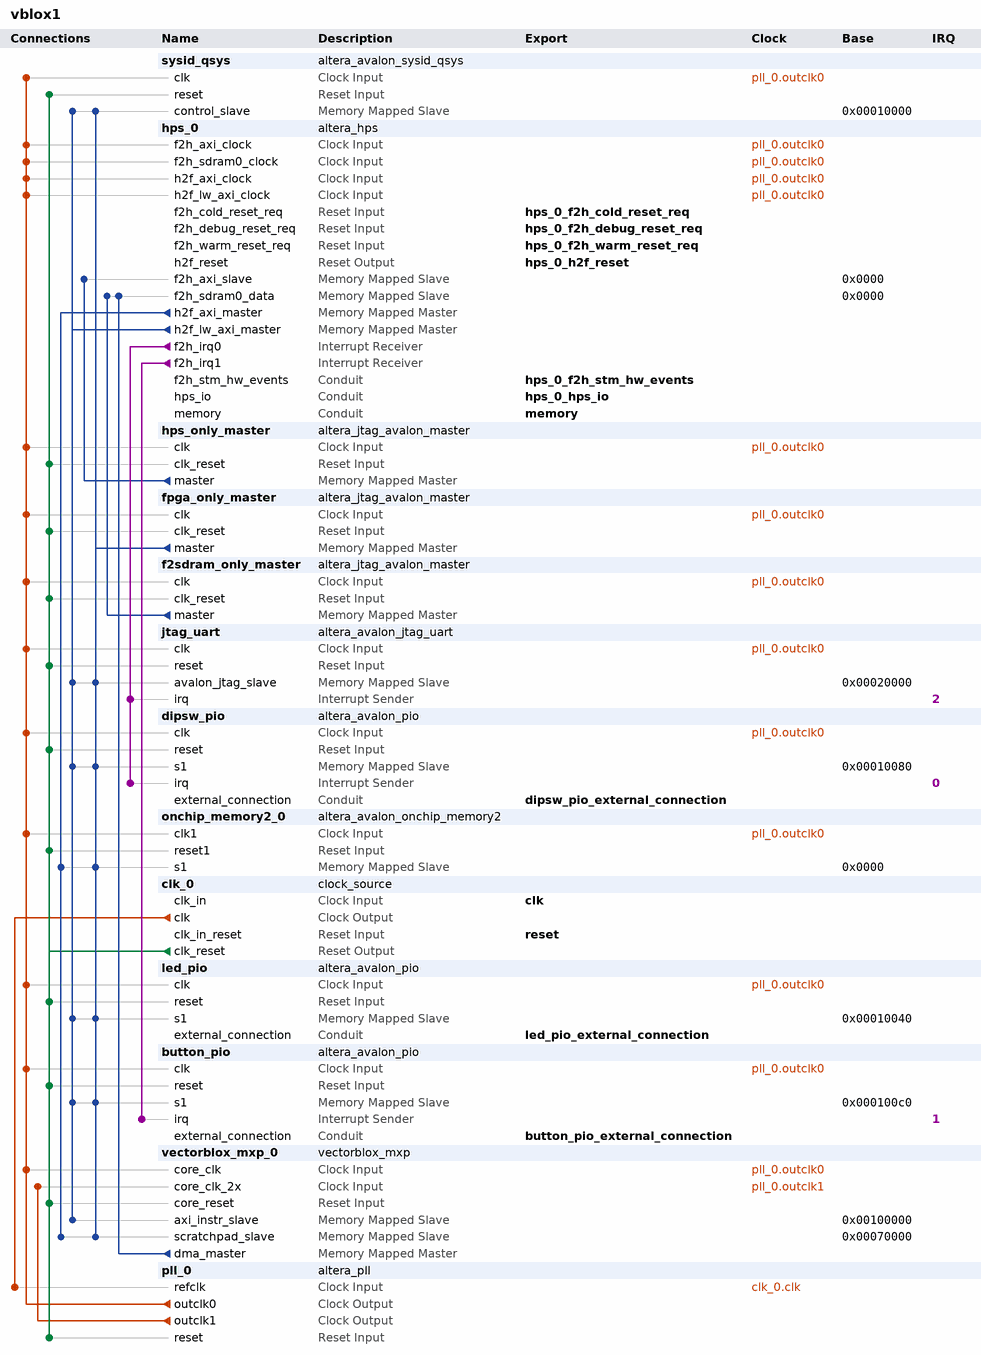
[diagram p0: system contents]
# Platform Designer (Qsys) system vblox1, Cyclone V 5CSXFC6D6F31C6
# Parameters at their usual value, and those the tool derives, are not listed.
package require -exact qsys 15.0
create_system vblox1
set_project_property DEVICE_FAMILY {Cyclone V}
set_project_property DEVICE 5CSXFC6D6F31C6

add_instance sysid_qsys altera_avalon_sysid_qsys 15.0
set_instance_parameter_value sysid_qsys id -1395322110

add_instance hps_0 altera_hps 15.0
set_instance_parameter_value hps_0 EMAC1_Mode RGMII
set_instance_parameter_value hps_0 EMAC1_PinMuxing {HPS I/O Set 0}
set_instance_parameter_value hps_0 F2SCLK_COLDRST_Enable true
set_instance_parameter_value hps_0 F2SCLK_DBGRST_Enable true
set_instance_parameter_value hps_0 F2SCLK_WARMRST_Enable true
set_instance_parameter_value hps_0 F2SDRAM_Type {Avalon-MM Bidirectional}
set_instance_parameter_value hps_0 F2SDRAM_Width 256
set_instance_parameter_value hps_0 F2SINTERRUPT_Enable true
set_instance_parameter_value hps_0 F2S_Width 3
set_instance_parameter_value hps_0 FPGA_PERIPHERAL_OUTPUT_CLOCK_FREQ_EMAC0_GTX_CLK 100
set_instance_parameter_value hps_0 FPGA_PERIPHERAL_OUTPUT_CLOCK_FREQ_EMAC0_MD_CLK 100.0
set_instance_parameter_value hps_0 FPGA_PERIPHERAL_OUTPUT_CLOCK_FREQ_EMAC1_GTX_CLK 100
set_instance_parameter_value hps_0 FPGA_PERIPHERAL_OUTPUT_CLOCK_FREQ_EMAC1_MD_CLK 100.0
set_instance_parameter_value hps_0 HPS_PROTOCOL DDR3
set_instance_parameter_value hps_0 I2C0_Mode N/A
set_instance_parameter_value hps_0 I2C0_PinMuxing Unused
set_instance_parameter_value hps_0 I2C1_Mode I2C
set_instance_parameter_value hps_0 I2C1_PinMuxing {HPS I/O Set 0}
set_instance_parameter_value hps_0 LWH2F_Enable true
set_instance_parameter_value hps_0 MEM_BANKADDR_WIDTH 3
set_instance_parameter_value hps_0 MEM_CLK_FREQ 400.0
set_instance_parameter_value hps_0 MEM_COL_ADDR_WIDTH 10
set_instance_parameter_value hps_0 MEM_DQ_WIDTH 32
set_instance_parameter_value hps_0 MEM_DRV_STR RZQ/7
set_instance_parameter_value hps_0 MEM_ROW_ADDR_WIDTH 15
set_instance_parameter_value hps_0 MEM_RTT_NOM RZQ/4
set_instance_parameter_value hps_0 MEM_RTT_WR RZQ/4
set_instance_parameter_value hps_0 MEM_TCL 11
set_instance_parameter_value hps_0 MEM_TFAW_NS 30.0
set_instance_parameter_value hps_0 MEM_TRAS_NS 35.0
set_instance_parameter_value hps_0 MEM_TRCD_NS 13.75
set_instance_parameter_value hps_0 MEM_TRFC_NS 260.0
set_instance_parameter_value hps_0 MEM_TRP_NS 13.75
set_instance_parameter_value hps_0 MEM_VENDOR Micron
set_instance_parameter_value hps_0 MEM_WTCL 8
set_instance_parameter_value hps_0 QSPI_Mode {1 SS}
set_instance_parameter_value hps_0 QSPI_PinMuxing {HPS I/O Set 0}
set_instance_parameter_value hps_0 REF_CLK_FREQ 25.0
set_instance_parameter_value hps_0 S2F_Width 2
set_instance_parameter_value hps_0 SDIO_Mode {4-bit Data}
set_instance_parameter_value hps_0 SDIO_PinMuxing {HPS I/O Set 0}
set_instance_parameter_value hps_0 SPIM0_Mode {Single Slave Select}
set_instance_parameter_value hps_0 SPIM0_PinMuxing {HPS I/O Set 0}
set_instance_parameter_value hps_0 SPIM1_Mode {Single Slave Select}
set_instance_parameter_value hps_0 SPIM1_PinMuxing {HPS I/O Set 0}
set_instance_parameter_value hps_0 STM_Enable true
set_instance_parameter_value hps_0 TIMING_BOARD_AC_SKEW 0.03
set_instance_parameter_value hps_0 TIMING_BOARD_AC_TO_CK_SKEW 0.0
set_instance_parameter_value hps_0 TIMING_BOARD_DQ_TO_DQS_SKEW 0.0
set_instance_parameter_value hps_0 TIMING_BOARD_MAX_CK_DELAY 0.03
set_instance_parameter_value hps_0 TIMING_BOARD_MAX_DQS_DELAY 0.02
set_instance_parameter_value hps_0 TIMING_BOARD_SKEW_BETWEEN_DQS 0.08
set_instance_parameter_value hps_0 TIMING_BOARD_SKEW_CKDQS_DIMM_MAX 0.16
set_instance_parameter_value hps_0 TIMING_BOARD_SKEW_CKDQS_DIMM_MIN 0.09
set_instance_parameter_value hps_0 TIMING_BOARD_SKEW_WITHIN_DQS 0.01
set_instance_parameter_value hps_0 TIMING_TDH 65
set_instance_parameter_value hps_0 TIMING_TDQSCK 255
set_instance_parameter_value hps_0 TIMING_TDQSQ 125
set_instance_parameter_value hps_0 TIMING_TDS 30
set_instance_parameter_value hps_0 TIMING_TIH 140
set_instance_parameter_value hps_0 TIMING_TIS 180
set_instance_parameter_value hps_0 TIMING_TQSH 0.4
set_instance_parameter_value hps_0 UART0_Mode {No Flow Control}
set_instance_parameter_value hps_0 UART0_PinMuxing {HPS I/O Set 0}
set_instance_parameter_value hps_0 USB1_Mode N/A
set_instance_parameter_value hps_0 USB1_PinMuxing Unused
set_instance_parameter_value hps_0 desired_cfg_clk_mhz 100.0
set_instance_parameter_value hps_0 desired_qspi_clk_mhz 400.0
set_instance_parameter_value hps_0 use_default_mpu_clk false

add_instance hps_only_master altera_jtag_avalon_master 15.0

add_instance fpga_only_master altera_jtag_avalon_master 15.0

add_instance f2sdram_only_master altera_jtag_avalon_master 15.0

add_instance jtag_uart altera_avalon_jtag_uart 15.0
set_instance_parameter_value jtag_uart allowMultipleConnections true
set_instance_parameter_value jtag_uart simInteractiveOptions INTERACTIVE_ASCII_OUTPUT

add_instance dipsw_pio altera_avalon_pio 15.0
set_instance_parameter_value dipsw_pio bitClearingEdgeCapReg true
set_instance_parameter_value dipsw_pio captureEdge true
set_instance_parameter_value dipsw_pio direction Input
set_instance_parameter_value dipsw_pio edgeType ANY
set_instance_parameter_value dipsw_pio generateIRQ true
set_instance_parameter_value dipsw_pio irqType EDGE
set_instance_parameter_value dipsw_pio width 4

add_instance onchip_memory2_0 altera_avalon_onchip_memory2 15.0
set_instance_parameter_value onchip_memory2_0 dataWidth 64
set_instance_parameter_value onchip_memory2_0 dualPort false
set_instance_parameter_value onchip_memory2_0 initMemContent true
set_instance_parameter_value onchip_memory2_0 initializationFileName onchip_memory2_0
set_instance_parameter_value onchip_memory2_0 memorySize 65536

add_instance clk_0 clock_source 15.0
set_instance_parameter_value clk_0 clockFrequency 50000000

add_instance led_pio altera_avalon_pio 15.0
set_instance_parameter_value led_pio direction Output
set_instance_parameter_value led_pio width 4

add_instance button_pio altera_avalon_pio 15.0
set_instance_parameter_value button_pio captureEdge true
set_instance_parameter_value button_pio direction Input
set_instance_parameter_value button_pio edgeType FALLING
set_instance_parameter_value button_pio generateIRQ true
set_instance_parameter_value button_pio irqType EDGE
set_instance_parameter_value button_pio width 4

add_instance vectorblox_mxp_0 vectorblox_mxp 1.1
set_instance_parameter_value vectorblox_mxp_0 BEATS_PER_BURST 32
set_instance_parameter_value vectorblox_mxp_0 CI_CLK_DOMAIN 0
set_instance_parameter_value vectorblox_mxp_0 CI_CLK_RATE 0
set_instance_parameter_value vectorblox_mxp_0 CORE_CLK_2X_DOMAIN 8
set_instance_parameter_value vectorblox_mxp_0 CORE_CLK_2X_RATE 200000000
set_instance_parameter_value vectorblox_mxp_0 CORE_CLK_DOMAIN 7
set_instance_parameter_value vectorblox_mxp_0 CORE_CLK_RATE 100000000
set_instance_parameter_value vectorblox_mxp_0 INSTR_PORT_ID_WIDTH 14
set_instance_parameter_value vectorblox_mxp_0 INSTR_PORT_TYPE AXI
set_instance_parameter_value vectorblox_mxp_0 MASK_PARTITIONS 1
set_instance_parameter_value vectorblox_mxp_0 MAX_MASKED_WAVES 256
set_instance_parameter_value vectorblox_mxp_0 MEMORY_WIDTH_LANES 8
set_instance_parameter_value vectorblox_mxp_0 MIN_MULTIPLIER_HW BYTE
set_instance_parameter_value vectorblox_mxp_0 MULFXP_BYTE_FRACTION_BITS 4
set_instance_parameter_value vectorblox_mxp_0 MULFXP_HALF_FRACTION_BITS 15
set_instance_parameter_value vectorblox_mxp_0 MULFXP_WORD_FRACTION_BITS 16
set_instance_parameter_value vectorblox_mxp_0 SCRATCHPAD_KB 64
set_instance_parameter_value vectorblox_mxp_0 SLAVE_WIDTH_LANES 1
set_instance_parameter_value vectorblox_mxp_0 UNIQUE_ID {$${FILENAME}_vectorblox_mxp_0}
set_instance_parameter_value vectorblox_mxp_0 VCI_0_FUNCTIONS 1
set_instance_parameter_value vectorblox_mxp_0 VCI_0_FUNCTION_0_DEPTH 0
set_instance_parameter_value vectorblox_mxp_0 VCI_0_FUNCTION_10_DEPTH 0
set_instance_parameter_value vectorblox_mxp_0 VCI_0_FUNCTION_11_DEPTH 0
set_instance_parameter_value vectorblox_mxp_0 VCI_0_FUNCTION_12_DEPTH 0
set_instance_parameter_value vectorblox_mxp_0 VCI_0_FUNCTION_13_DEPTH 0
set_instance_parameter_value vectorblox_mxp_0 VCI_0_FUNCTION_14_DEPTH 0
set_instance_parameter_value vectorblox_mxp_0 VCI_0_FUNCTION_15_DEPTH 0
set_instance_parameter_value vectorblox_mxp_0 VCI_0_FUNCTION_1_DEPTH 0
set_instance_parameter_value vectorblox_mxp_0 VCI_0_FUNCTION_2_DEPTH 0
set_instance_parameter_value vectorblox_mxp_0 VCI_0_FUNCTION_3_DEPTH 0
set_instance_parameter_value vectorblox_mxp_0 VCI_0_FUNCTION_4_DEPTH 0
set_instance_parameter_value vectorblox_mxp_0 VCI_0_FUNCTION_5_DEPTH 0
set_instance_parameter_value vectorblox_mxp_0 VCI_0_FUNCTION_6_DEPTH 0
set_instance_parameter_value vectorblox_mxp_0 VCI_0_FUNCTION_7_DEPTH 0
set_instance_parameter_value vectorblox_mxp_0 VCI_0_FUNCTION_8_DEPTH 0
set_instance_parameter_value vectorblox_mxp_0 VCI_0_FUNCTION_9_DEPTH 0
set_instance_parameter_value vectorblox_mxp_0 VCI_0_LANES 1
set_instance_parameter_value vectorblox_mxp_0 VCI_0_MODIFIES_DEST_ADDR false
set_instance_parameter_value vectorblox_mxp_0 VCI_0_OPCODE_START 0
set_instance_parameter_value vectorblox_mxp_0 VCI_10_FUNCTIONS 1
set_instance_parameter_value vectorblox_mxp_0 VCI_10_FUNCTION_0_DEPTH 0
set_instance_parameter_value vectorblox_mxp_0 VCI_10_FUNCTION_1_DEPTH 0
set_instance_parameter_value vectorblox_mxp_0 VCI_10_FUNCTION_2_DEPTH 0
set_instance_parameter_value vectorblox_mxp_0 VCI_10_FUNCTION_3_DEPTH 0
set_instance_parameter_value vectorblox_mxp_0 VCI_10_FUNCTION_4_DEPTH 0
set_instance_parameter_value vectorblox_mxp_0 VCI_10_FUNCTION_5_DEPTH 0
set_instance_parameter_value vectorblox_mxp_0 VCI_10_LANES 1
set_instance_parameter_value vectorblox_mxp_0 VCI_10_MODIFIES_DEST_ADDR false
set_instance_parameter_value vectorblox_mxp_0 VCI_10_OPCODE_START 10
set_instance_parameter_value vectorblox_mxp_0 VCI_11_FUNCTIONS 1
set_instance_parameter_value vectorblox_mxp_0 VCI_11_FUNCTION_0_DEPTH 0
set_instance_parameter_value vectorblox_mxp_0 VCI_11_FUNCTION_1_DEPTH 0
set_instance_parameter_value vectorblox_mxp_0 VCI_11_FUNCTION_2_DEPTH 0
set_instance_parameter_value vectorblox_mxp_0 VCI_11_FUNCTION_3_DEPTH 0
set_instance_parameter_value vectorblox_mxp_0 VCI_11_FUNCTION_4_DEPTH 0
set_instance_parameter_value vectorblox_mxp_0 VCI_11_LANES 1
set_instance_parameter_value vectorblox_mxp_0 VCI_11_MODIFIES_DEST_ADDR false
set_instance_parameter_value vectorblox_mxp_0 VCI_11_OPCODE_START 11
set_instance_parameter_value vectorblox_mxp_0 VCI_12_FUNCTIONS 1
set_instance_parameter_value vectorblox_mxp_0 VCI_12_FUNCTION_0_DEPTH 0
set_instance_parameter_value vectorblox_mxp_0 VCI_12_FUNCTION_1_DEPTH 0
set_instance_parameter_value vectorblox_mxp_0 VCI_12_FUNCTION_2_DEPTH 0
set_instance_parameter_value vectorblox_mxp_0 VCI_12_FUNCTION_3_DEPTH 0
set_instance_parameter_value vectorblox_mxp_0 VCI_12_LANES 1
set_instance_parameter_value vectorblox_mxp_0 VCI_12_MODIFIES_DEST_ADDR false
set_instance_parameter_value vectorblox_mxp_0 VCI_12_OPCODE_START 12
set_instance_parameter_value vectorblox_mxp_0 VCI_13_FUNCTIONS 1
set_instance_parameter_value vectorblox_mxp_0 VCI_13_FUNCTION_0_DEPTH 0
set_instance_parameter_value vectorblox_mxp_0 VCI_13_FUNCTION_1_DEPTH 0
set_instance_parameter_value vectorblox_mxp_0 VCI_13_FUNCTION_2_DEPTH 0
set_instance_parameter_value vectorblox_mxp_0 VCI_13_LANES 1
set_instance_parameter_value vectorblox_mxp_0 VCI_13_MODIFIES_DEST_ADDR false
set_instance_parameter_value vectorblox_mxp_0 VCI_13_OPCODE_START 13
set_instance_parameter_value vectorblox_mxp_0 VCI_14_FUNCTIONS 1
set_instance_parameter_value vectorblox_mxp_0 VCI_14_FUNCTION_0_DEPTH 0
set_instance_parameter_value vectorblox_mxp_0 VCI_14_FUNCTION_1_DEPTH 0
set_instance_parameter_value vectorblox_mxp_0 VCI_14_LANES 1
set_instance_parameter_value vectorblox_mxp_0 VCI_14_MODIFIES_DEST_ADDR false
set_instance_parameter_value vectorblox_mxp_0 VCI_14_OPCODE_START 14
set_instance_parameter_value vectorblox_mxp_0 VCI_15_FUNCTIONS 1
set_instance_parameter_value vectorblox_mxp_0 VCI_15_FUNCTION_0_DEPTH 0
set_instance_parameter_value vectorblox_mxp_0 VCI_15_LANES 1
set_instance_parameter_value vectorblox_mxp_0 VCI_15_MODIFIES_DEST_ADDR false
set_instance_parameter_value vectorblox_mxp_0 VCI_15_OPCODE_START 15
set_instance_parameter_value vectorblox_mxp_0 VCI_1_FUNCTIONS 1
set_instance_parameter_value vectorblox_mxp_0 VCI_1_FUNCTION_0_DEPTH 0
set_instance_parameter_value vectorblox_mxp_0 VCI_1_FUNCTION_10_DEPTH 0
set_instance_parameter_value vectorblox_mxp_0 VCI_1_FUNCTION_11_DEPTH 0
set_instance_parameter_value vectorblox_mxp_0 VCI_1_FUNCTION_12_DEPTH 0
set_instance_parameter_value vectorblox_mxp_0 VCI_1_FUNCTION_13_DEPTH 0
set_instance_parameter_value vectorblox_mxp_0 VCI_1_FUNCTION_14_DEPTH 0
set_instance_parameter_value vectorblox_mxp_0 VCI_1_FUNCTION_1_DEPTH 0
set_instance_parameter_value vectorblox_mxp_0 VCI_1_FUNCTION_2_DEPTH 0
set_instance_parameter_value vectorblox_mxp_0 VCI_1_FUNCTION_3_DEPTH 0
set_instance_parameter_value vectorblox_mxp_0 VCI_1_FUNCTION_4_DEPTH 0
set_instance_parameter_value vectorblox_mxp_0 VCI_1_FUNCTION_5_DEPTH 0
set_instance_parameter_value vectorblox_mxp_0 VCI_1_FUNCTION_6_DEPTH 0
set_instance_parameter_value vectorblox_mxp_0 VCI_1_FUNCTION_7_DEPTH 0
set_instance_parameter_value vectorblox_mxp_0 VCI_1_FUNCTION_8_DEPTH 0
set_instance_parameter_value vectorblox_mxp_0 VCI_1_FUNCTION_9_DEPTH 0
set_instance_parameter_value vectorblox_mxp_0 VCI_1_LANES 1
set_instance_parameter_value vectorblox_mxp_0 VCI_1_MODIFIES_DEST_ADDR false
set_instance_parameter_value vectorblox_mxp_0 VCI_1_OPCODE_START 1
set_instance_parameter_value vectorblox_mxp_0 VCI_2_FUNCTIONS 1
set_instance_parameter_value vectorblox_mxp_0 VCI_2_FUNCTION_0_DEPTH 0
set_instance_parameter_value vectorblox_mxp_0 VCI_2_FUNCTION_10_DEPTH 0
set_instance_parameter_value vectorblox_mxp_0 VCI_2_FUNCTION_11_DEPTH 0
set_instance_parameter_value vectorblox_mxp_0 VCI_2_FUNCTION_12_DEPTH 0
set_instance_parameter_value vectorblox_mxp_0 VCI_2_FUNCTION_13_DEPTH 0
set_instance_parameter_value vectorblox_mxp_0 VCI_2_FUNCTION_1_DEPTH 0
set_instance_parameter_value vectorblox_mxp_0 VCI_2_FUNCTION_2_DEPTH 0
set_instance_parameter_value vectorblox_mxp_0 VCI_2_FUNCTION_3_DEPTH 0
set_instance_parameter_value vectorblox_mxp_0 VCI_2_FUNCTION_4_DEPTH 0
set_instance_parameter_value vectorblox_mxp_0 VCI_2_FUNCTION_5_DEPTH 0
set_instance_parameter_value vectorblox_mxp_0 VCI_2_FUNCTION_6_DEPTH 0
set_instance_parameter_value vectorblox_mxp_0 VCI_2_FUNCTION_7_DEPTH 0
set_instance_parameter_value vectorblox_mxp_0 VCI_2_FUNCTION_8_DEPTH 0
set_instance_parameter_value vectorblox_mxp_0 VCI_2_FUNCTION_9_DEPTH 0
set_instance_parameter_value vectorblox_mxp_0 VCI_2_LANES 1
set_instance_parameter_value vectorblox_mxp_0 VCI_2_MODIFIES_DEST_ADDR false
set_instance_parameter_value vectorblox_mxp_0 VCI_2_OPCODE_START 2
set_instance_parameter_value vectorblox_mxp_0 VCI_3_FUNCTIONS 1
set_instance_parameter_value vectorblox_mxp_0 VCI_3_FUNCTION_0_DEPTH 0
set_instance_parameter_value vectorblox_mxp_0 VCI_3_FUNCTION_10_DEPTH 0
set_instance_parameter_value vectorblox_mxp_0 VCI_3_FUNCTION_11_DEPTH 0
set_instance_parameter_value vectorblox_mxp_0 VCI_3_FUNCTION_12_DEPTH 0
set_instance_parameter_value vectorblox_mxp_0 VCI_3_FUNCTION_1_DEPTH 0
set_instance_parameter_value vectorblox_mxp_0 VCI_3_FUNCTION_2_DEPTH 0
set_instance_parameter_value vectorblox_mxp_0 VCI_3_FUNCTION_3_DEPTH 0
set_instance_parameter_value vectorblox_mxp_0 VCI_3_FUNCTION_4_DEPTH 0
set_instance_parameter_value vectorblox_mxp_0 VCI_3_FUNCTION_5_DEPTH 0
set_instance_parameter_value vectorblox_mxp_0 VCI_3_FUNCTION_6_DEPTH 0
set_instance_parameter_value vectorblox_mxp_0 VCI_3_FUNCTION_7_DEPTH 0
set_instance_parameter_value vectorblox_mxp_0 VCI_3_FUNCTION_8_DEPTH 0
set_instance_parameter_value vectorblox_mxp_0 VCI_3_FUNCTION_9_DEPTH 0
set_instance_parameter_value vectorblox_mxp_0 VCI_3_LANES 1
set_instance_parameter_value vectorblox_mxp_0 VCI_3_MODIFIES_DEST_ADDR false
set_instance_parameter_value vectorblox_mxp_0 VCI_3_OPCODE_START 3
set_instance_parameter_value vectorblox_mxp_0 VCI_4_FUNCTIONS 1
set_instance_parameter_value vectorblox_mxp_0 VCI_4_FUNCTION_0_DEPTH 0
set_instance_parameter_value vectorblox_mxp_0 VCI_4_FUNCTION_10_DEPTH 0
set_instance_parameter_value vectorblox_mxp_0 VCI_4_FUNCTION_11_DEPTH 0
set_instance_parameter_value vectorblox_mxp_0 VCI_4_FUNCTION_1_DEPTH 0
set_instance_parameter_value vectorblox_mxp_0 VCI_4_FUNCTION_2_DEPTH 0
set_instance_parameter_value vectorblox_mxp_0 VCI_4_FUNCTION_3_DEPTH 0
set_instance_parameter_value vectorblox_mxp_0 VCI_4_FUNCTION_4_DEPTH 0
set_instance_parameter_value vectorblox_mxp_0 VCI_4_FUNCTION_5_DEPTH 0
set_instance_parameter_value vectorblox_mxp_0 VCI_4_FUNCTION_6_DEPTH 0
set_instance_parameter_value vectorblox_mxp_0 VCI_4_FUNCTION_7_DEPTH 0
set_instance_parameter_value vectorblox_mxp_0 VCI_4_FUNCTION_8_DEPTH 0
set_instance_parameter_value vectorblox_mxp_0 VCI_4_FUNCTION_9_DEPTH 0
set_instance_parameter_value vectorblox_mxp_0 VCI_4_LANES 1
set_instance_parameter_value vectorblox_mxp_0 VCI_4_MODIFIES_DEST_ADDR false
set_instance_parameter_value vectorblox_mxp_0 VCI_4_OPCODE_START 4
set_instance_parameter_value vectorblox_mxp_0 VCI_5_FUNCTIONS 1
set_instance_parameter_value vectorblox_mxp_0 VCI_5_FUNCTION_0_DEPTH 0
set_instance_parameter_value vectorblox_mxp_0 VCI_5_FUNCTION_10_DEPTH 0
set_instance_parameter_value vectorblox_mxp_0 VCI_5_FUNCTION_1_DEPTH 0
set_instance_parameter_value vectorblox_mxp_0 VCI_5_FUNCTION_2_DEPTH 0
set_instance_parameter_value vectorblox_mxp_0 VCI_5_FUNCTION_3_DEPTH 0
set_instance_parameter_value vectorblox_mxp_0 VCI_5_FUNCTION_4_DEPTH 0
set_instance_parameter_value vectorblox_mxp_0 VCI_5_FUNCTION_5_DEPTH 0
set_instance_parameter_value vectorblox_mxp_0 VCI_5_FUNCTION_6_DEPTH 0
set_instance_parameter_value vectorblox_mxp_0 VCI_5_FUNCTION_7_DEPTH 0
set_instance_parameter_value vectorblox_mxp_0 VCI_5_FUNCTION_8_DEPTH 0
set_instance_parameter_value vectorblox_mxp_0 VCI_5_FUNCTION_9_DEPTH 0
set_instance_parameter_value vectorblox_mxp_0 VCI_5_LANES 1
set_instance_parameter_value vectorblox_mxp_0 VCI_5_MODIFIES_DEST_ADDR false
set_instance_parameter_value vectorblox_mxp_0 VCI_5_OPCODE_START 5
set_instance_parameter_value vectorblox_mxp_0 VCI_6_FUNCTIONS 1
set_instance_parameter_value vectorblox_mxp_0 VCI_6_FUNCTION_0_DEPTH 0
set_instance_parameter_value vectorblox_mxp_0 VCI_6_FUNCTION_1_DEPTH 0
set_instance_parameter_value vectorblox_mxp_0 VCI_6_FUNCTION_2_DEPTH 0
set_instance_parameter_value vectorblox_mxp_0 VCI_6_FUNCTION_3_DEPTH 0
set_instance_parameter_value vectorblox_mxp_0 VCI_6_FUNCTION_4_DEPTH 0
set_instance_parameter_value vectorblox_mxp_0 VCI_6_FUNCTION_5_DEPTH 0
set_instance_parameter_value vectorblox_mxp_0 VCI_6_FUNCTION_6_DEPTH 0
set_instance_parameter_value vectorblox_mxp_0 VCI_6_FUNCTION_7_DEPTH 0
set_instance_parameter_value vectorblox_mxp_0 VCI_6_FUNCTION_8_DEPTH 0
set_instance_parameter_value vectorblox_mxp_0 VCI_6_FUNCTION_9_DEPTH 0
set_instance_parameter_value vectorblox_mxp_0 VCI_6_LANES 1
set_instance_parameter_value vectorblox_mxp_0 VCI_6_MODIFIES_DEST_ADDR false
set_instance_parameter_value vectorblox_mxp_0 VCI_6_OPCODE_START 6
set_instance_parameter_value vectorblox_mxp_0 VCI_7_FUNCTIONS 1
set_instance_parameter_value vectorblox_mxp_0 VCI_7_FUNCTION_0_DEPTH 0
set_instance_parameter_value vectorblox_mxp_0 VCI_7_FUNCTION_1_DEPTH 0
set_instance_parameter_value vectorblox_mxp_0 VCI_7_FUNCTION_2_DEPTH 0
set_instance_parameter_value vectorblox_mxp_0 VCI_7_FUNCTION_3_DEPTH 0
set_instance_parameter_value vectorblox_mxp_0 VCI_7_FUNCTION_4_DEPTH 0
set_instance_parameter_value vectorblox_mxp_0 VCI_7_FUNCTION_5_DEPTH 0
set_instance_parameter_value vectorblox_mxp_0 VCI_7_FUNCTION_6_DEPTH 0
set_instance_parameter_value vectorblox_mxp_0 VCI_7_FUNCTION_7_DEPTH 0
set_instance_parameter_value vectorblox_mxp_0 VCI_7_FUNCTION_8_DEPTH 0
set_instance_parameter_value vectorblox_mxp_0 VCI_7_LANES 1
set_instance_parameter_value vectorblox_mxp_0 VCI_7_MODIFIES_DEST_ADDR false
set_instance_parameter_value vectorblox_mxp_0 VCI_7_OPCODE_START 7
set_instance_parameter_value vectorblox_mxp_0 VCI_8_FUNCTIONS 1
set_instance_parameter_value vectorblox_mxp_0 VCI_8_FUNCTION_0_DEPTH 0
set_instance_parameter_value vectorblox_mxp_0 VCI_8_FUNCTION_1_DEPTH 0
set_instance_parameter_value vectorblox_mxp_0 VCI_8_FUNCTION_2_DEPTH 0
set_instance_parameter_value vectorblox_mxp_0 VCI_8_FUNCTION_3_DEPTH 0
set_instance_parameter_value vectorblox_mxp_0 VCI_8_FUNCTION_4_DEPTH 0
set_instance_parameter_value vectorblox_mxp_0 VCI_8_FUNCTION_5_DEPTH 0
set_instance_parameter_value vectorblox_mxp_0 VCI_8_FUNCTION_6_DEPTH 0
set_instance_parameter_value vectorblox_mxp_0 VCI_8_FUNCTION_7_DEPTH 0
set_instance_parameter_value vectorblox_mxp_0 VCI_8_LANES 1
set_instance_parameter_value vectorblox_mxp_0 VCI_8_MODIFIES_DEST_ADDR false
set_instance_parameter_value vectorblox_mxp_0 VCI_8_OPCODE_START 8
set_instance_parameter_value vectorblox_mxp_0 VCI_9_FUNCTIONS 1
set_instance_parameter_value vectorblox_mxp_0 VCI_9_FUNCTION_0_DEPTH 0
set_instance_parameter_value vectorblox_mxp_0 VCI_9_FUNCTION_1_DEPTH 0
set_instance_parameter_value vectorblox_mxp_0 VCI_9_FUNCTION_2_DEPTH 0
set_instance_parameter_value vectorblox_mxp_0 VCI_9_FUNCTION_3_DEPTH 0
set_instance_parameter_value vectorblox_mxp_0 VCI_9_FUNCTION_4_DEPTH 0
set_instance_parameter_value vectorblox_mxp_0 VCI_9_FUNCTION_5_DEPTH 0
set_instance_parameter_value vectorblox_mxp_0 VCI_9_FUNCTION_6_DEPTH 0
set_instance_parameter_value vectorblox_mxp_0 VCI_9_LANES 1
set_instance_parameter_value vectorblox_mxp_0 VCI_9_MODIFIES_DEST_ADDR false
set_instance_parameter_value vectorblox_mxp_0 VCI_9_OPCODE_START 9
set_instance_parameter_value vectorblox_mxp_0 VECTOR_CUSTOM_INSTRUCTIONS 0
set_instance_parameter_value vectorblox_mxp_0 VECTOR_LANES 8

add_instance pll_0 altera_pll 15.0
set_instance_parameter_value pll_0 gui_device_speed_grade 2
set_instance_parameter_value pll_0 gui_number_of_clocks 2
set_instance_parameter_value pll_0 gui_operation_mode direct
set_instance_parameter_value pll_0 gui_output_clock_frequency0 100.0
set_instance_parameter_value pll_0 gui_output_clock_frequency1 200.0
set_instance_parameter_value pll_0 gui_pll_mode {Integer-N PLL}
set_instance_parameter_value pll_0 gui_reference_clock_frequency 50.0
set_instance_parameter_value pll_0 gui_use_locked false

# connections
add_connection clk_0.clk pll_0.refclk clock
add_connection pll_0.outclk0 button_pio.clk clock
add_connection pll_0.outclk0 dipsw_pio.clk clock
add_connection pll_0.outclk0 f2sdram_only_master.clk clock
add_connection pll_0.outclk0 fpga_only_master.clk clock
add_connection pll_0.outclk0 hps_0.f2h_axi_clock clock
add_connection pll_0.outclk0 hps_0.f2h_sdram0_clock clock
add_connection pll_0.outclk0 hps_0.h2f_axi_clock clock
add_connection pll_0.outclk0 hps_0.h2f_lw_axi_clock clock
add_connection pll_0.outclk0 hps_only_master.clk clock
add_connection pll_0.outclk0 jtag_uart.clk clock
add_connection pll_0.outclk0 led_pio.clk clock
add_connection pll_0.outclk0 onchip_memory2_0.clk1 clock
add_connection pll_0.outclk0 sysid_qsys.clk clock
add_connection pll_0.outclk0 vectorblox_mxp_0.core_clk clock
add_connection pll_0.outclk1 vectorblox_mxp_0.core_clk_2x clock
add_connection clk_0.clk_reset button_pio.reset reset
add_connection clk_0.clk_reset dipsw_pio.reset reset
add_connection clk_0.clk_reset f2sdram_only_master.clk_reset reset
add_connection clk_0.clk_reset fpga_only_master.clk_reset reset
add_connection clk_0.clk_reset hps_only_master.clk_reset reset
add_connection clk_0.clk_reset jtag_uart.reset reset
add_connection clk_0.clk_reset led_pio.reset reset
add_connection clk_0.clk_reset onchip_memory2_0.reset1 reset
add_connection clk_0.clk_reset pll_0.reset reset
add_connection clk_0.clk_reset sysid_qsys.reset reset
add_connection clk_0.clk_reset vectorblox_mxp_0.core_reset reset
add_connection f2sdram_only_master.master hps_0.f2h_sdram0_data avalon
set_connection_parameter_value f2sdram_only_master.master/hps_0.f2h_sdram0_data baseAddress 0x0000
add_connection fpga_only_master.master button_pio.s1 avalon
set_connection_parameter_value fpga_only_master.master/button_pio.s1 baseAddress 0x000100c0
add_connection fpga_only_master.master dipsw_pio.s1 avalon
set_connection_parameter_value fpga_only_master.master/dipsw_pio.s1 baseAddress 0x00010080
add_connection fpga_only_master.master jtag_uart.avalon_jtag_slave avalon
set_connection_parameter_value fpga_only_master.master/jtag_uart.avalon_jtag_slave baseAddress 0x00020000
add_connection fpga_only_master.master led_pio.s1 avalon
set_connection_parameter_value fpga_only_master.master/led_pio.s1 baseAddress 0x00010040
add_connection fpga_only_master.master onchip_memory2_0.s1 avalon
set_connection_parameter_value fpga_only_master.master/onchip_memory2_0.s1 baseAddress 0x0000
add_connection fpga_only_master.master sysid_qsys.control_slave avalon
set_connection_parameter_value fpga_only_master.master/sysid_qsys.control_slave baseAddress 0x00010000
add_connection fpga_only_master.master vectorblox_mxp_0.scratchpad_slave avalon
set_connection_parameter_value fpga_only_master.master/vectorblox_mxp_0.scratchpad_slave baseAddress 0x00070000
add_connection hps_0.h2f_axi_master onchip_memory2_0.s1 avalon
set_connection_parameter_value hps_0.h2f_axi_master/onchip_memory2_0.s1 baseAddress 0x0000
add_connection hps_0.h2f_axi_master vectorblox_mxp_0.scratchpad_slave avalon
set_connection_parameter_value hps_0.h2f_axi_master/vectorblox_mxp_0.scratchpad_slave baseAddress 0x00070000
add_connection hps_0.h2f_lw_axi_master button_pio.s1 avalon
set_connection_parameter_value hps_0.h2f_lw_axi_master/button_pio.s1 baseAddress 0x000100c0
add_connection hps_0.h2f_lw_axi_master dipsw_pio.s1 avalon
set_connection_parameter_value hps_0.h2f_lw_axi_master/dipsw_pio.s1 baseAddress 0x00010080
add_connection hps_0.h2f_lw_axi_master jtag_uart.avalon_jtag_slave avalon
set_connection_parameter_value hps_0.h2f_lw_axi_master/jtag_uart.avalon_jtag_slave baseAddress 0x00020000
add_connection hps_0.h2f_lw_axi_master led_pio.s1 avalon
set_connection_parameter_value hps_0.h2f_lw_axi_master/led_pio.s1 baseAddress 0x00010040
add_connection hps_0.h2f_lw_axi_master sysid_qsys.control_slave avalon
set_connection_parameter_value hps_0.h2f_lw_axi_master/sysid_qsys.control_slave baseAddress 0x00010000
add_connection hps_0.h2f_lw_axi_master vectorblox_mxp_0.axi_instr_slave avalon
set_connection_parameter_value hps_0.h2f_lw_axi_master/vectorblox_mxp_0.axi_instr_slave baseAddress 0x00100000
add_connection hps_only_master.master hps_0.f2h_axi_slave avalon
set_connection_parameter_value hps_only_master.master/hps_0.f2h_axi_slave baseAddress 0x0000
add_connection vectorblox_mxp_0.dma_master hps_0.f2h_sdram0_data avalon
set_connection_parameter_value vectorblox_mxp_0.dma_master/hps_0.f2h_sdram0_data baseAddress 0x0000
add_connection hps_0.f2h_irq0 dipsw_pio.irq interrupt
set_connection_parameter_value hps_0.f2h_irq0/dipsw_pio.irq irqNumber 0
add_connection hps_0.f2h_irq0 jtag_uart.irq interrupt
set_connection_parameter_value hps_0.f2h_irq0/jtag_uart.irq irqNumber 2
add_connection hps_0.f2h_irq1 button_pio.irq interrupt
set_connection_parameter_value hps_0.f2h_irq1/button_pio.irq irqNumber 1

# exported interfaces
add_interface button_pio_external_connection conduit end
set_interface_property button_pio_external_connection EXPORT_OF button_pio.external_connection
add_interface clk clock sink
set_interface_property clk EXPORT_OF clk_0.clk_in
add_interface dipsw_pio_external_connection conduit end
set_interface_property dipsw_pio_external_connection EXPORT_OF dipsw_pio.external_connection
add_interface hps_0_f2h_cold_reset_req reset sink
set_interface_property hps_0_f2h_cold_reset_req EXPORT_OF hps_0.f2h_cold_reset_req
add_interface hps_0_f2h_debug_reset_req reset sink
set_interface_property hps_0_f2h_debug_reset_req EXPORT_OF hps_0.f2h_debug_reset_req
add_interface hps_0_f2h_stm_hw_events conduit end
set_interface_property hps_0_f2h_stm_hw_events EXPORT_OF hps_0.f2h_stm_hw_events
add_interface hps_0_f2h_warm_reset_req reset sink
set_interface_property hps_0_f2h_warm_reset_req EXPORT_OF hps_0.f2h_warm_reset_req
add_interface hps_0_h2f_reset reset source
set_interface_property hps_0_h2f_reset EXPORT_OF hps_0.h2f_reset
add_interface hps_0_hps_io conduit end
set_interface_property hps_0_hps_io EXPORT_OF hps_0.hps_io
add_interface led_pio_external_connection conduit end
set_interface_property led_pio_external_connection EXPORT_OF led_pio.external_connection
add_interface memory conduit end
set_interface_property memory EXPORT_OF hps_0.memory
add_interface reset reset sink
set_interface_property reset EXPORT_OF clk_0.clk_in_reset

set_interconnect_requirement {$system} qsys_mm.clockCrossingAdapter HANDSHAKE
set_interconnect_requirement {$system} qsys_mm.insertDefaultSlave FALSE
set_interconnect_requirement {$system} qsys_mm.maxAdditionalLatency 1
set_interconnect_requirement hps_only_master.master qsys_mm.security SECURE

save_system vblox1.qsys
